# EAGLE schematic Scheda_motori_L293 (EAGLE 6.5.0)
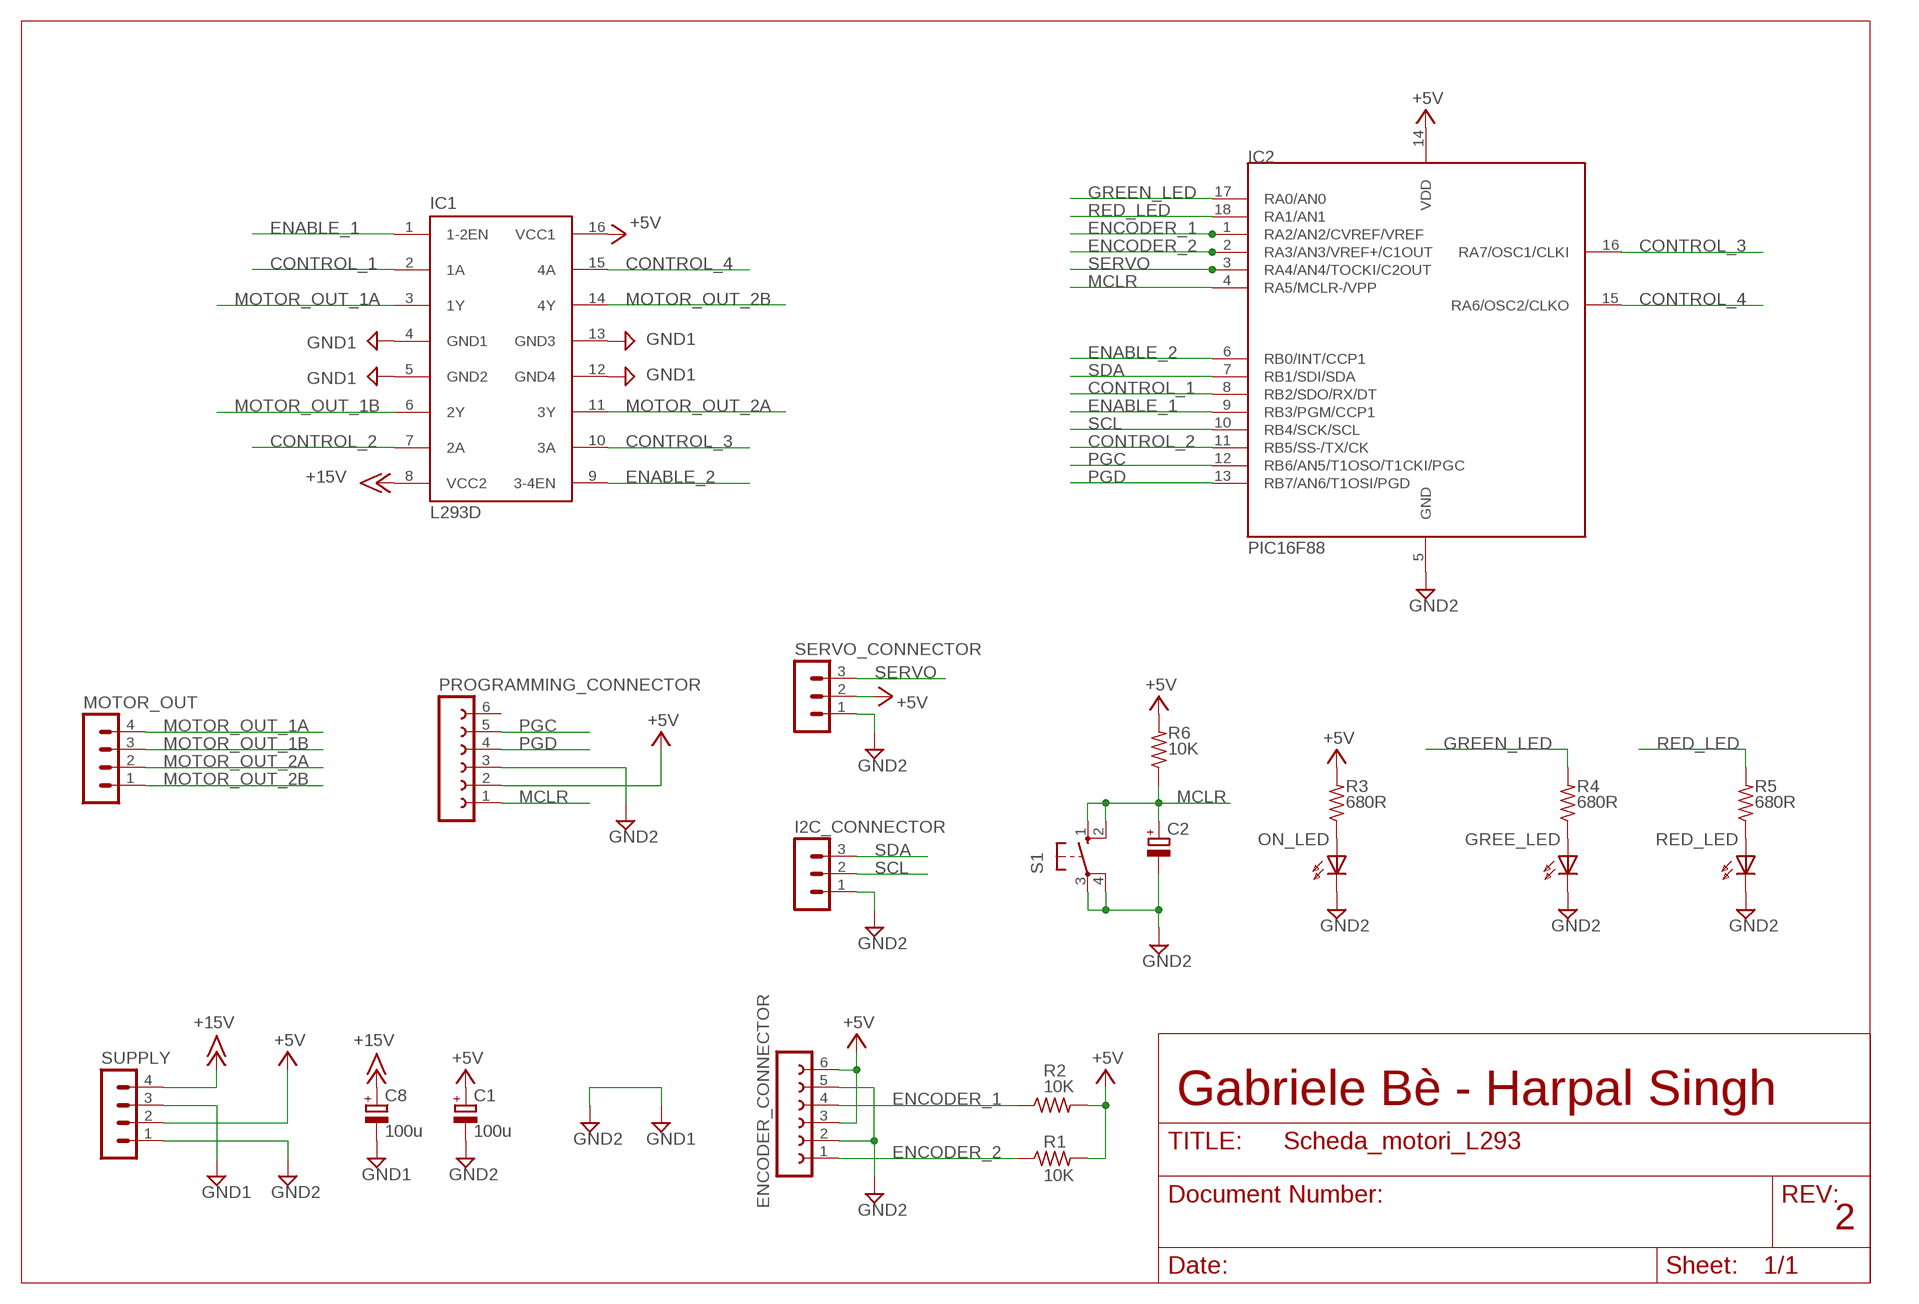
[diagram p0: schematic, sheet 1]

## Parts
C1  100u  CPOL-EUB45181B  [B45181B]
C2  CPOL-EUE2.5-7  [E2,5-7]
C8  100u  CPOL-EUE2.5-7  [E2,5-7]
ENCODER_CONNECTOR  FE06-1  [FE06]
GREE_LED  HLMP6  [HLMP6]
I2C_CONNECTOR  MA03-1  [MA03-1]
IC1  L293D  [DIL16]
IC2  PIC16F88  [DIL18]
MOTOR_OUT  MA04-1  [MA04-1]
ON_LED  HLMP6  [HLMP6]
PROGRAMMING_CONNECTOR  FE06-1  [FE06]
R1  10K  R-US_0207/10  [0207/10]
R2  10K  R-US_0207/10  [0207/10]
R3  680R  R-US_0207/10  [0207/10]
R4  680R  R-US_0207/10  [0207/10]
R5  680R  R-US_0207/10  [0207/10]
R6  10K  R-US_0207/10  [0207/10]
RED_LED  HLMP6  [HLMP6]
S1  10-XX  [B3F-10XX]
SERVO_CONNECTOR  MA03-1  [MA03-1]
SUPPLY  MA04-1  [MA04-1]

## Nets
+5V: C1.+ ENCODER_CONNECTOR.3 ENCODER_CONNECTOR.6 IC1.16(VCC1) IC2.14(VDD) PROGRAMMING_CONNECTOR.2 R1.2 R2.2 R3.2 R6.2 SERVO_CONNECTOR.2 SUPPLY.2
+15V: C8.+ IC1.8(VCC2) SUPPLY.4
CONTROL_1: IC1.2(1A) IC2.8(RB2/SDO/RX/DT)
CONTROL_2: IC1.7(2A) IC2.11(RB5/SS-/TX/CK)
CONTROL_3: IC1.10(3A) IC2.16(RA7/OSC1/CLKI)
CONTROL_4: IC1.15(4A) IC2.15(RA6/OSC2/CLKO)
ENABLE_1: IC1.1(1-2EN) IC2.9(RB3/PGM/CCP1)
ENABLE_2: IC1.9(3-4EN) IC2.6(RB0/INT/CCP1)
ENCODER_1: ENCODER_CONNECTOR.4 IC2.1(RA2/AN2/CVREF/VREF) R2.1
ENCODER_2: ENCODER_CONNECTOR.1 IC2.2(RA3/AN3/VREF+/C1OUT) R1.1
GND1: C8.- IC1.4(GND1) IC1.5(GND2) IC1.12(GND4) IC1.13(GND3) SUPPLY.3
GND2: C1.- C2.- ENCODER_CONNECTOR.2 ENCODER_CONNECTOR.5 GREE_LED.K I2C_CONNECTOR.1 IC2.5(GND) ON_LED.K PROGRAMMING_CONNECTOR.3 RED_LED.K S1.3(P) S1.4(P1) SERVO_CONNECTOR.1 SUPPLY.1 ; supply symbol labelled GND1
GREEN_LED: IC2.17(RA0/AN0) R4.2
MCLR: C2.+ IC2.4(RA5/MCLR-/VPP) PROGRAMMING_CONNECTOR.1 R6.1 S1.1(S) S1.2(S1)
MOTOR_OUT_1A: IC1.3(1Y) MOTOR_OUT.4
MOTOR_OUT_1B: IC1.6(2Y) MOTOR_OUT.3
MOTOR_OUT_2A: IC1.11(3Y) MOTOR_OUT.2
MOTOR_OUT_2B: IC1.14(4Y) MOTOR_OUT.1
N$3: ON_LED.A R3.1
N$4: GREE_LED.A R4.1
N$5: R5.1 RED_LED.A
PGC: IC2.12(RB6/AN5/T1OSO/T1CKI/PGC) PROGRAMMING_CONNECTOR.5
PGD: IC2.13(RB7/AN6/T1OSI/PGD) PROGRAMMING_CONNECTOR.4
RED_LED: IC2.18(RA1/AN1) R5.2
SCL: I2C_CONNECTOR.2 IC2.10(RB4/SCK/SCL)
SDA: I2C_CONNECTOR.3 IC2.7(RB1/SDI/SDA)
SERVO: IC2.3(RA4/AN4/TOCKI/C2OUT) SERVO_CONNECTOR.3
Unconnected: PROGRAMMING_CONNECTOR.6

## Notes on the sheet
- Gabriele Bè - Harpal Singh
- 2

## Library data of the parts
C1 C2 C8 = rcl:CPOL-EU: POLARIZED CAPACITOR, European symbol
ENCODER_CONNECTOR PROGRAMMING_CONNECTOR = con-lsta:FE06-1: FEMALE HEADER; OC_FARNELL: unknown; OC_NEWARK: unknown
GREE_LED ON_LED RED_LED = display-hp:HLMP6: LED 2mm horizontal; MF: AGILENT TECHNOLOGIES; MPN: HLMP-6500; OC_FARNELL: 1652490; OC_NEWARK: 40K0088
I2C_CONNECTOR SERVO_CONNECTOR = con-lstb:MA03-1: PIN HEADER; OC_FARNELL: unknown; OC_NEWARK: unknown
IC1 = st-microelectronics:L293D: PUSH-PULL 4 CHANNEL DRIVER; MPN: L293D; OC_FARNELL: 9589619; OC_NEWARK: 56P8249
IC2 = ITIS:PIC16F88
MOTOR_OUT SUPPLY = con-lstb:MA04-1: PIN HEADER; OC_FARNELL: unknown; OC_NEWARK: unknown
R1-R6 = resistor:R-US_: RESISTOR, American symbol
S1 = ITIS:10-XX: OMRON SWITCH